# Altium schematic sheet mux_lowside-V1_00.SchDoc: LED Cube Low Side
size A4
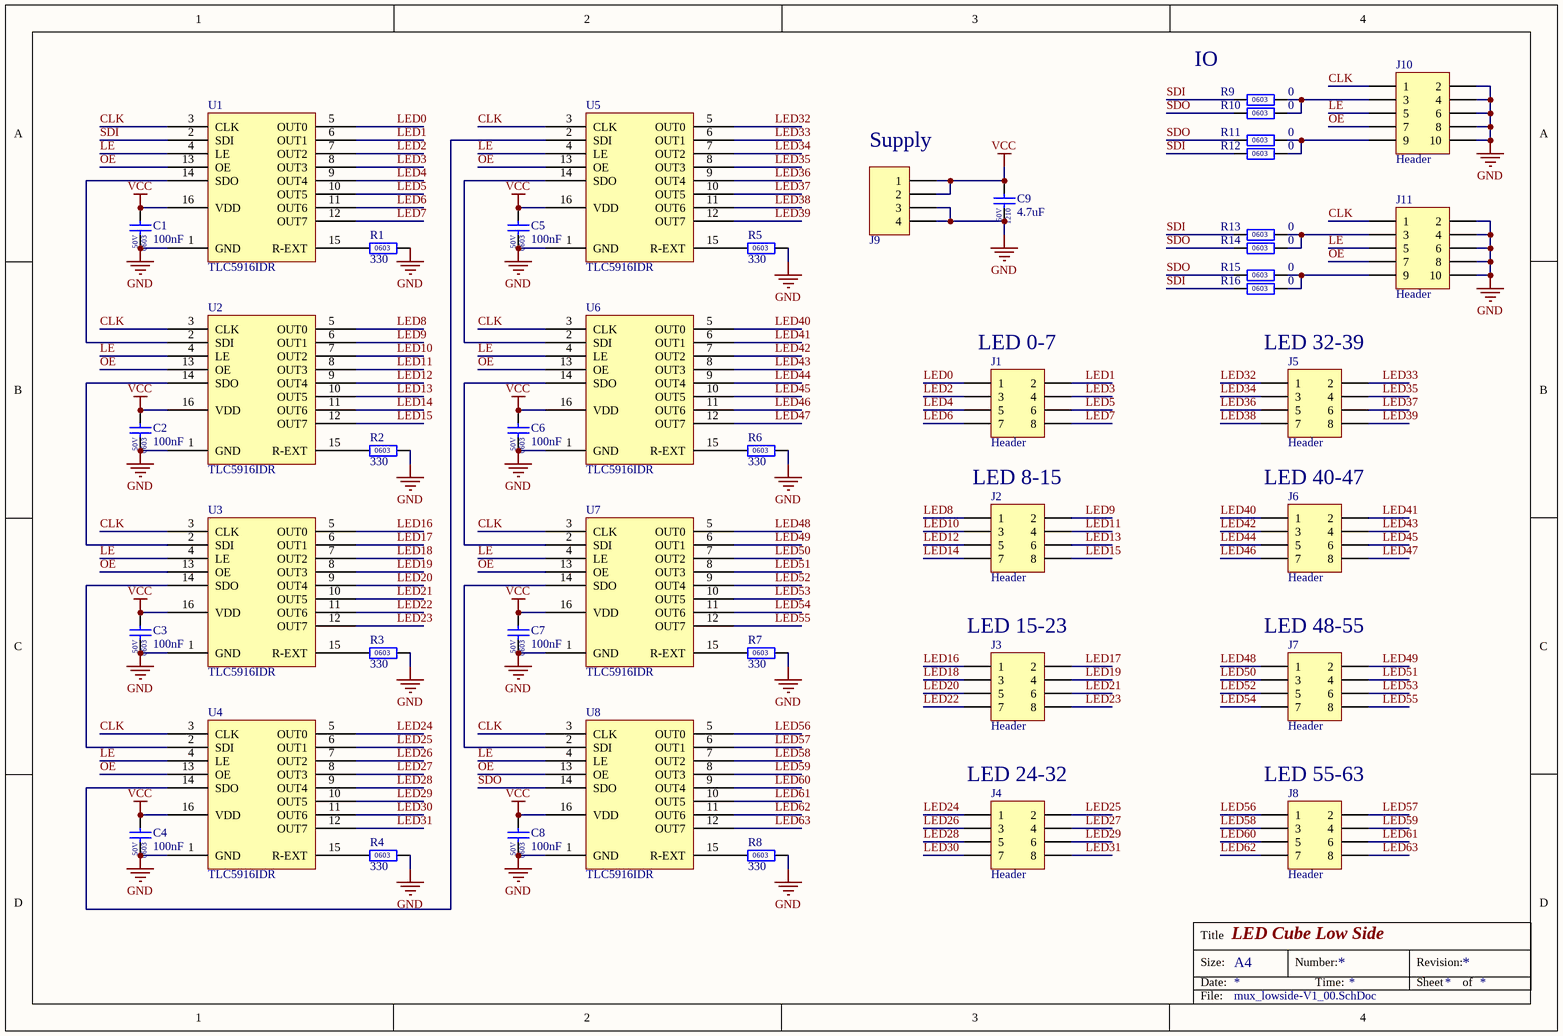
[diagram p0: mux_lowside-V1_00.SchDoc]

## Parts
C1  Max. Voltage: 50V  Capacity: 100nF  package: 0603  [CAPC1608X10M_SILK]  (hidden comment: Capacitor)
C2  Max. Voltage: 50V  Capacity: 100nF  package: 0603  [CAPC1608X10M_SILK]  (hidden comment: Capacitor)
C3  Max. Voltage: 50V  Capacity: 100nF  package: 0603  [CAPC1608X10M_SILK]  (hidden comment: Capacitor)
C4  Max. Voltage: 50V  Capacity: 100nF  package: 0603  [CAPC1608X10M_SILK]  (hidden comment: Capacitor)
C5  Max. Voltage: 50V  Capacity: 100nF  package: 0603  [CAPC1608X10M_SILK]  (hidden comment: Capacitor)
C6  Max. Voltage: 50V  Capacity: 100nF  package: 0603  [CAPC1608X10M_SILK]  (hidden comment: Capacitor)
C7  Max. Voltage: 50V  Capacity: 100nF  package: 0603  [CAPC1608X10M_SILK]  (hidden comment: Capacitor)
C8  Max. Voltage: 50V  Capacity: 100nF  package: 0603  [CAPC1608X10M_SILK]  (hidden comment: Capacitor)
C9  Max. Voltage: 50V  Capacity: 4.7uF  package: 1210  [CAPC3225X17M_SILK]  (hidden comment: Capacitor)
J1  Header  [61200821621]
J2  Header  [61200821621]
J3  Header  [61200821621]
J4  Header  [61200821621]
J5  Header  [61200821621]
J6  Header  [61200821621]
J7  Header  [61200821621]
J8  Header  [61200821621]
J9  MSTBA 2,5/ 4-G-5,08  [1757268]  (value not drawn)
J10  Header  [61201021721]
J11  Header  [61201021721]
R1  value 330  package: 0603  [RESC1608X06M_SILK]  (hidden comment: Resistor)
R2  value 330  package: 0603  [RESC1608X06M_SILK]  (hidden comment: Resistor)
R3  value 330  package: 0603  [RESC1608X06M_SILK]  (hidden comment: Resistor)
R4  value 330  package: 0603  [RESC1608X06M_SILK]  (hidden comment: Resistor)
R5  value 330  package: 0603  [RESC1608X06M_SILK]  (hidden comment: Resistor)
R6  value 330  package: 0603  [RESC1608X06M_SILK]  (hidden comment: Resistor)
R7  value 330  package: 0603  [RESC1608X06M_SILK]  (hidden comment: Resistor)
R8  value 330  package: 0603  [RESC1608X06M_SILK]  (hidden comment: Resistor)
R9  value 0  package: 0603  [RESC1608X06M_SILK]  (hidden comment: Resistor)
R10  value 0  package: 0603  [RESC1608X06M_SILK]  (hidden comment: Resistor)
R11  value 0  package: 0603  [RESC1608X06M_SILK]  (hidden comment: Resistor)
R12  value 0  package: 0603  [RESC1608X06M_SILK]  (hidden comment: Resistor)
R13  value 0  package: 0603  [RESC1608X06M_SILK]  (hidden comment: Resistor)
R14  value 0  package: 0603  [RESC1608X06M_SILK]  (hidden comment: Resistor)
R15  value 0  package: 0603  [RESC1608X06M_SILK]  (hidden comment: Resistor)
R16  value 0  package: 0603  [RESC1608X06M_SILK]  (hidden comment: Resistor)
U1  TLC5916IDR  [SOIC127P600X175-16M]
U2  TLC5916IDR  [SOIC127P600X175-16M]
U3  TLC5916IDR  [SOIC127P600X175-16M]
U4  TLC5916IDR  [SOIC127P600X175-16M]
U5  TLC5916IDR  [SOIC127P600X175-16M]
U6  TLC5916IDR  [SOIC127P600X175-16M]
U7  TLC5916IDR  [SOIC127P600X175-16M]
U8  TLC5916IDR  [SOIC127P600X175-16M]

## Nets
GND: C1.1 C2.1 C3.1 C4.1 C5.1 C6.1 C7.1 C8.1 C9.1 J9.3 J9.4 J10.2 J10.4 J10.6 J10.8 J10.10 J11.2 J11.4 J11.6 J11.8 J11.10 R1.2 R2.2 R3.2 R4.2 R5.2 R6.2 R7.2 R8.2 U1.1(GND) U2.1(GND) U3.1(GND) U4.1(GND) U5.1(GND) U6.1(GND) U7.1(GND) U8.1(GND)
VCC: C1.2 C2.2 C3.2 C4.2 C5.2 C6.2 C7.2 C8.2 C9.2 J9.1 J9.2 U1.16(VDD) U2.16(VDD) U3.16(VDD) U4.16(VDD) U5.16(VDD) U6.16(VDD) U7.16(VDD) U8.16(VDD)
CLK: J10.1 J11.1 U1.3(CLK) U2.3(CLK) U3.3(CLK) U4.3(CLK) U5.3(CLK) U6.3(CLK) U7.3(CLK) U8.3(CLK)
LE: J10.5 J11.5 U1.4(LE) U2.4(LE) U3.4(LE) U4.4(LE) U5.4(LE) U6.4(LE) U7.4(LE) U8.4(LE)
LED0: J1.1 U1.5(OUT0)
LED1: J1.2 U1.6(OUT1)
LED2: J1.3 U1.7(OUT2)
LED3: J1.4 U1.8(OUT3)
LED4: J1.5 U1.9(OUT4)
LED5: J1.6 U1.10(OUT5)
LED6: J1.7 U1.11(OUT6)
LED7: J1.8 U1.12(OUT7)
LED8: J2.1 U2.5(OUT0)
LED9: J2.2 U2.6(OUT1)
LED10: J2.3 U2.7(OUT2)
LED11: J2.4 U2.8(OUT3)
LED12: J2.5 U2.9(OUT4)
LED13: J2.6 U2.10(OUT5)
LED14: J2.7 U2.11(OUT6)
LED15: J2.8 U2.12(OUT7)
LED16: J3.1 U3.5(OUT0)
LED17: J3.2 U3.6(OUT1)
LED18: J3.3 U3.7(OUT2)
LED19: J3.4 U3.8(OUT3)
LED20: J3.5 U3.9(OUT4)
LED21: J3.6 U3.10(OUT5)
LED22: J3.7 U3.11(OUT6)
LED23: J3.8 U3.12(OUT7)
LED24: J4.1 U4.5(OUT0)
LED25: J4.2 U4.6(OUT1)
LED26: J4.3 U4.7(OUT2)
LED27: J4.4 U4.8(OUT3)
LED28: J4.5 U4.9(OUT4)
LED29: J4.6 U4.10(OUT5)
LED30: J4.7 U4.11(OUT6)
LED31: J4.8 U4.12(OUT7)
LED32: J5.1 U5.5(OUT0)
LED33: J5.2 U5.6(OUT1)
LED34: J5.3 U5.7(OUT2)
LED35: J5.4 U5.8(OUT3)
LED36: J5.5 U5.9(OUT4)
LED37: J5.6 U5.10(OUT5)
LED38: J5.7 U5.11(OUT6)
LED39: J5.8 U5.12(OUT7)
LED40: J6.1 U6.5(OUT0)
LED41: J6.2 U6.6(OUT1)
LED42: J6.3 U6.7(OUT2)
LED43: J6.4 U6.8(OUT3)
LED44: J6.5 U6.9(OUT4)
LED45: J6.6 U6.10(OUT5)
LED46: J6.7 U6.11(OUT6)
LED47: J6.8 U6.12(OUT7)
LED48: J7.1 U7.5(OUT0)
LED49: J7.2 U7.6(OUT1)
LED50: J7.3 U7.7(OUT2)
LED51: J7.4 U7.8(OUT3)
LED52: J7.5 U7.9(OUT4)
LED53: J7.6 U7.10(OUT5)
LED54: J7.7 U7.11(OUT6)
LED55: J7.8 U7.12(OUT7)
LED56: J8.1 U8.5(OUT0)
LED57: J8.2 U8.6(OUT1)
LED58: J8.3 U8.7(OUT2)
LED59: J8.4 U8.8(OUT3)
LED60: J8.5 U8.9(OUT4)
LED61: J8.6 U8.10(OUT5)
LED62: J8.7 U8.11(OUT6)
LED63: J8.8 U8.12(OUT7)
OE: J10.7 J11.7 U1.13(OE) U2.13(OE) U3.13(OE) U4.13(OE) U5.13(OE) U6.13(OE) U7.13(OE) U8.13(OE)
SDI: R9.1 R12.1 R13.1 R16.1 U1.2(SDI)
SDO: R10.1 R11.1 R14.1 R15.1 U8.14(SDO)
NetJ10_3: J10.3 R9.2 R10.2
NetJ10_9: J10.9 R11.2 R12.2
NetJ11_3: J11.3 R13.2 R14.2
NetJ11_9: J11.9 R15.2 R16.2
NetR1_1: R1.1 U1.15(R-EXT)
NetR2_1: R2.1 U2.15(R-EXT)
NetR3_1: R3.1 U3.15(R-EXT)
NetR4_1: R4.1 U4.15(R-EXT)
NetR5_1: R5.1 U5.15(R-EXT)
NetR6_1: R6.1 U6.15(R-EXT)
NetR7_1: R7.1 U7.15(R-EXT)
NetR8_1: R8.1 U8.15(R-EXT)
NetU1_14: U1.14(SDO) U2.2(SDI)
NetU2_14: U2.14(SDO) U3.2(SDI)
NetU3_14: U3.14(SDO) U4.2(SDI)
NetU4_14: U4.14(SDO) U5.2(SDI)
NetU5_14: U5.14(SDO) U6.2(SDI)
NetU6_14: U6.14(SDO) U7.2(SDI)
NetU7_14: U7.14(SDO) U8.2(SDI)

## Notes on the sheet
- IO
- (near J9) Supply
- (near J1) LED 0-7
- LED 32-39
- LED 8-15
- LED 40-47
- (near J3) LED 15-23
- (near J7) LED 48-55
- (near J4) LED 24-32
- (near J8) LED 55-63
- Title
- Size:
- Date:
- A4
- Number:
- Time:
- Revision:
- Sheet
- of
- File:

## Library data of the parts
C1-C8 = 11026540: CAP nF100   50V 0603 X7R 10%; Manufacturer: Samsung; Manufacturer Number: CL10B104KB8NNNC; Temp. Range: -55 .. 125°C; Part Number: 11026540; Technology: X7R; Tolerance: 10%; SMD: yes; Pin Count: 2; SAP-Nr.: 11026540; RoHS: yes
C9 = 10159411: CAP uF  4.7 50V 1210 X7R 10%; Manufacturer: Samsung; Manufacturer Number: CL21A475KPFNNNE; Temp. Range: -55 .. 125°C; Part Number: 10159411; Technology: X7R; Tolerance: 10%; SMD: yes; Pin Count: 2; SAP-Nr.: 10159411; RoHS: yes
J1-J8 = 61200821621: Box Header Male THT 2.54mm straight 8pos; Manufacturer: Wuerth; Nr. of positions: 8; Max. voltage: 250V; Max. current: 3A; Temp. Range: -40 to 125°C; Part Number: 61200821621; Type: Header Male; SMD: no; Pin Count: 8; RoHS: yes; Manufacturer Number: 61200821621; Supplier 1: Digikey; Supplier Part Number 1: 732-5395-ND
J9 = MSTBA 2,5/ 4-G-5,08: PCB Header, 2.54mm, angled, 4pol; Manufacturer: Phoenix Contact; Information: 5.08mm; Nr. of positions: 4; Max. voltage: 250V; Max. current: 15A; Part Number: MSTBA 2,5/ 4-G-5,08; Type: Connector; SMD: No; Pin Count: 4; RoHS: yes; Manufacturer Number: 1757268; Supplier 1: Digikey; Supplier Part Number 1: 277-1108-ND
J10 J11 = 61201021721: Box Header Male THT 2.54mm angled 10pos; Manufacturer: Wuerth; Nr. of positions: 10; Max. voltage: 250V; Max. current: 3A; Temp. Range: -40 to 125°C; Part Number: 61201021721; Type: Header Male; SMD: no; Pin Count: 10; RoHS: yes; Manufacturer Number: 61201021721; Supplier 1: Digikey; Supplier Part Number 1: 732-2098-ND
R1-R8 = RES_330_0603: Resistor 330 1% 0603; Manufacturer: Yaego; Manufacturer Number: RC0603FR-07330RL; Power Dissipation: 100mW; Temp. Range: -50°C to 150°C; Part Number: RES_330_0603; Technology: thick film; Tolerance: 1%; SMD: yes; Pin Count: 2; RoHS: yes
R9-R16 = RES_0_0603: Resistor 0 1% 0603; Manufacturer: Yaego; Manufacturer Number: RC0603JR-070RL; Power Dissipation: 100mW; Temp. Range: -50°C to 150°C; Part Number: RES_0_0603; Technology: thick film; Tolerance: 1%; SMD: yes; Pin Count: 2; RoHS: yes
U1-U8 = TLC5916IDR: TLC5916IDR 8 channel LED Const. Current Sink Driver; Manufacturer: Texas Instruments; Information 1: 8 Channel, serial input; Information 2: 3-5V; 120mA; Temp. Range: -40..+125°C; Part Number: TLC5916IDR; Type: LED-Driver; Package: SOIC-16; SMD: yes; Pin Count: 16; RoHS: yes; Manufacturer Number: TLC5916IDR; Supplier 1: Digikey; Supplier Part Number 1: 296-22710-1-ND